# Altium schematic sheet Memory.SchDoc
size A4
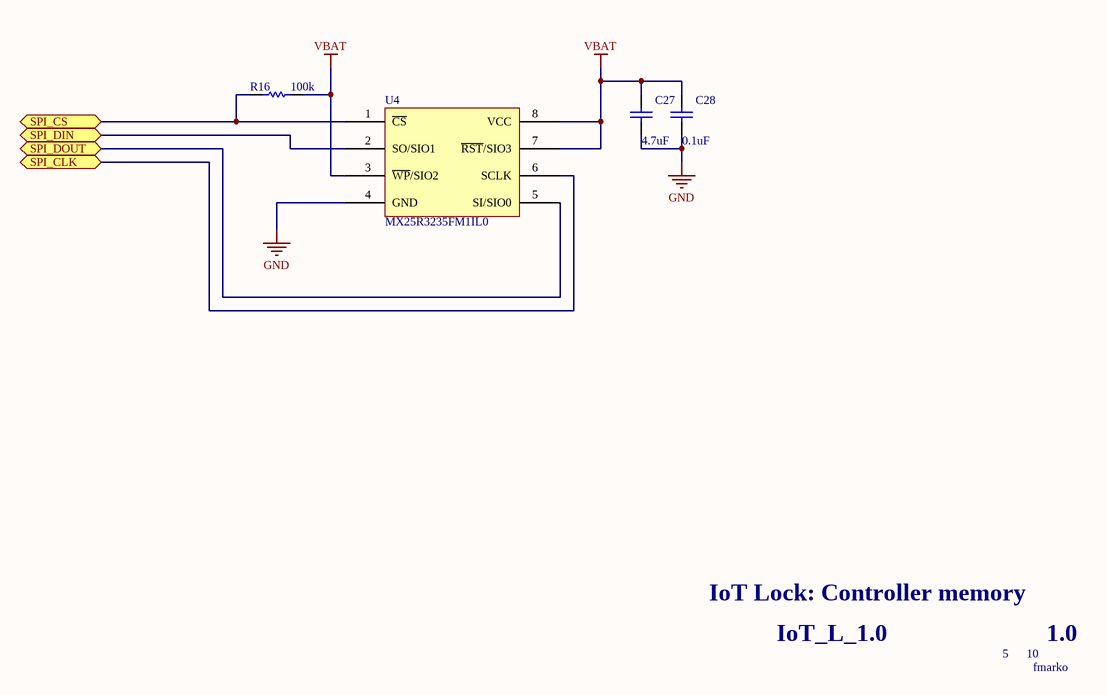
[diagram p0: Memory.SchDoc]

## Parts
C27  value 4.7uF  [0402]  (hidden comment: GRM1555C1HR50BA01D)
C28  value 0.1uF  [0402]  (hidden comment: GRM1555C1HR50BA01D)
R16  value 100k  [0402]  (hidden comment: Res Semi)
U4  MX25R3235FM1IL0  [SOP127P600X175-8N]

## Ports
SPI_CLK, SPI_CS, SPI_DIN, SPI_DOUT

## Nets
GND: C27.1 C28.1 U4.4(GND)
VBAT: C27.2 C28.2 R16.2 U4.3(~{WP}/SIO2) U4.7(~{RST}/SIO3) U4.8(VCC)
SPI_CLK: U4.6(SCLK) ; port SPI_CLK
SPI_CS: R16.1 U4.1(~{CS}) ; port SPI_CS
SPI_DIN: U4.2(SO/SIO1) ; port SPI_DIN
SPI_DOUT: U4.5(SI/SIO0) ; port SPI_DOUT

## Notes on the sheet
- IoT Lock: Controller memory
- IoT_L_1.0
- 5
- 10
- 1.0
- fmarko

## Library data of the parts
C27 C28 = Cap: Capacitor; Published: 8-Jun-2000; LatestRevisionDate: 17-Jul-2002; LatestRevisionNote: Re-released for DXP Platform.; PackageReference: RAD-0.3; Publisher: Altium Limited; PackageDescription: Radial Cap, Thru-Hole; 2 Leads; 0.3 in Pin Spacing
R16 = Res Semi: Semiconductor Resistor; Published: 8-Jun-2000; LatestRevisionDate: 17-Jul-2002; LatestRevisionNote: Re-released for DXP Platform.; PackageReference: AXIAL-0.5; Publisher: Altium Limited; PackageDescription: Axial Device, Thru-Hole; 2 Leads; 0.5 in Pin Spacing
U4 = MX25R3235FM1IL0: Macronix 32 Mbit SPI Flash memory